# Altium schematic sheet 243-436_USB-to-UART.SchDoc: USB à UART
size Letter; ApprovedBy: APPROUVÉ PAR; Engineer: K.Cotton; Organization: Cegep Limoilou; Address1: 1300, 8e Avenue; Address2: Québec, QC; Address3: Canada; Address4: G1J 5L5; SheetNumber: 4; SheetTotal: 4
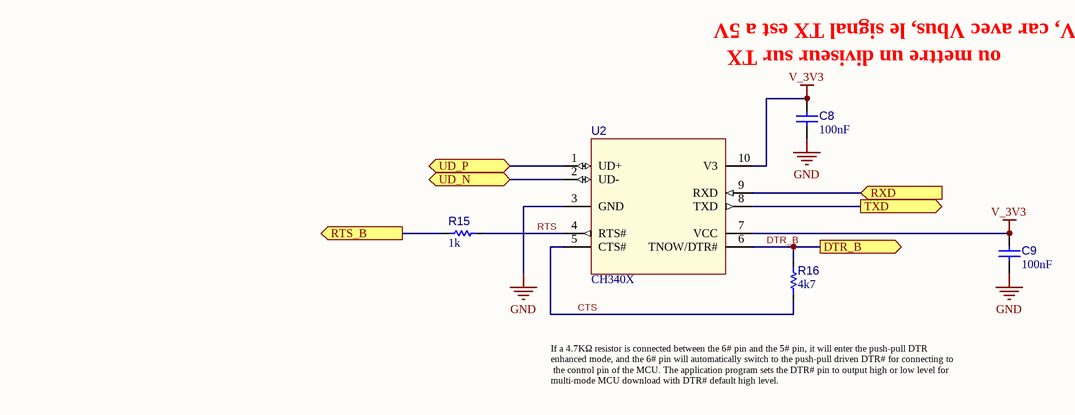
[diagram p0: 243-436_USB-to-UART.SchDoc]

## Parts
C8  value 100nF  [C_1005[0402]]  (hidden comment: CAP CER 100nF 50V 0402)
C9  value 100nF  [C_1005[0402]]  (hidden comment: CAP CER 100nF 50V 0402)
R15  value 1k  [R_1005[0402]]  (hidden comment: Res 1k 1% 0402)
R16  value 4k7  [R_1005[0402]]  (hidden comment: Res 4k7 1% 0402)
U2  CH340X  [U_MSOP50P300X500-10(RM-10)_WO-TP]

## Ports
DTR_B (out, see 243-436_Manette-ESP32[3C]), RTS_B (out, see 243-436_Manette-ESP32[3C]), RXD (in, see 243-436_Manette-ESP32[3C]), TXD (out, see 243-436_Manette-ESP32[3C]), UD_N (bidir, see 243-436_Manette-ESP32[4C]), UD_P (bidir, see 243-436_Manette-ESP32[4C])

## Nets
GND: C8.1 C9.1 U2.3(GND)
V_3V3: C8.2 C9.2 U2.7(VCC) U2.10(V3)
CTS: R16.1 U2.5(CTS#)
DTR_B: R16.2 U2.6(TNOW/DTR#) ; port DTR_B
RTS: R15.2 U2.4(RTS#)
RTS_B: R15.1 ; port RTS_B
RXD: U2.9(RXD) ; port RXD
TXD: U2.8(TXD) ; port TXD
UD_N: U2.2(UD-) ; port UD_N
UD_P: U2.1(UD+) ; port UD_P

## Notes on the sheet
- passer en mode 3.3V, car avec Vbus, le signal TX est a 5V
- (near C8) ou mettre un diviseur sur TX
- (near R16) If a 4.7KΩ resistor is connected between the 6# pin and the 5# pin, it will enter the push-pull DTR
  enhanced mode, and the 6# pin will automatically switch to the push-pull driven DTR# for connecting to
  the control pin of the MCU. The application program sets the DTR# pin to output high or low level for
  multi-mode MCU download with DTR# default high level.
- Titre :
- Conception :
- Date :
- Approbation :
- Heure :
- Révision :
- Feuille
- de
- Fichier :

## Library data of the parts
C8 C9 = CAP001: Capacitor type 1; Manufacturer 1: Yageo; Manufacturer Part Number 1: CC0402KRX7R9BB104; LibRef: CAP001; Tolerance: 10%; Dielectric: X7R; Code CEGEP: KCOND01SM; Rated Voltage: 50V; Mounting Technology: SMT; Supplier 1: LCSC; Supplier Part Number 1: C131394
R15 = RES006: Resistor type 1; Manufacturer 1: Yageo; Manufacturer Part Number 1: RC0402FR-071kL; LibRef: RES006; Puissance: 1/16W; Max Working Voltage: 50V; Code CEGEP: RES1KSM; Tolerance: 1%; Mounting Technology: SMT; Supplier 1: LCSC; Supplier Part Number 1: C106235
R16 = RES007: Resistor type 1; Manufacturer 1: Yageo; Manufacturer Part Number 1: RC0402FR-074K7L; LibRef: RES007; Puissance: 1/16W; Max Working Voltage: 50V; Code CEGEP: RES4.7KSM; Tolerance: 1%; Mounting Technology: SMT; Supplier 1: LCSC; Supplier Part Number 1: C105871
U2 = U_CH340X: IC USB to Serial Port; Manufacturer 1: WCH(Jiangsu Qin Heng); Manufacturer Part Number 1: CH340X; Mounting Technology: SMT; Supplier 1: LCSC; Supplier Part Number 1: C3035748